# Altium schematic sheet RGB_CCM.SchDoc: =project_title
size Tabloid; PageSetup: Record=PageOptions|CenterHorizontal=True|CenterVertical=True|PrintScale=0.71|XCorrection=1.00|YCorrection=1.00|PrintKind=0|BorderSize=5000000|LeftOffset=0|BottomOffset=0|Orientation=2|PaperLength=1000|PaperWidth=1000|Scale=100|PaperSource=7|PrintQuality=-4|MediaType=1|DitherType=10|PrintScaleMode=1|PaperKind=A4; CompanyName: Luxonis Holding; Organization: Luxonis Holding; Address1: 1925 Harmony Park Drive; Address2: Westminster, CO; Address3: 80234; Address4: United States; SheetNumber: 12; SheetTotal: 13
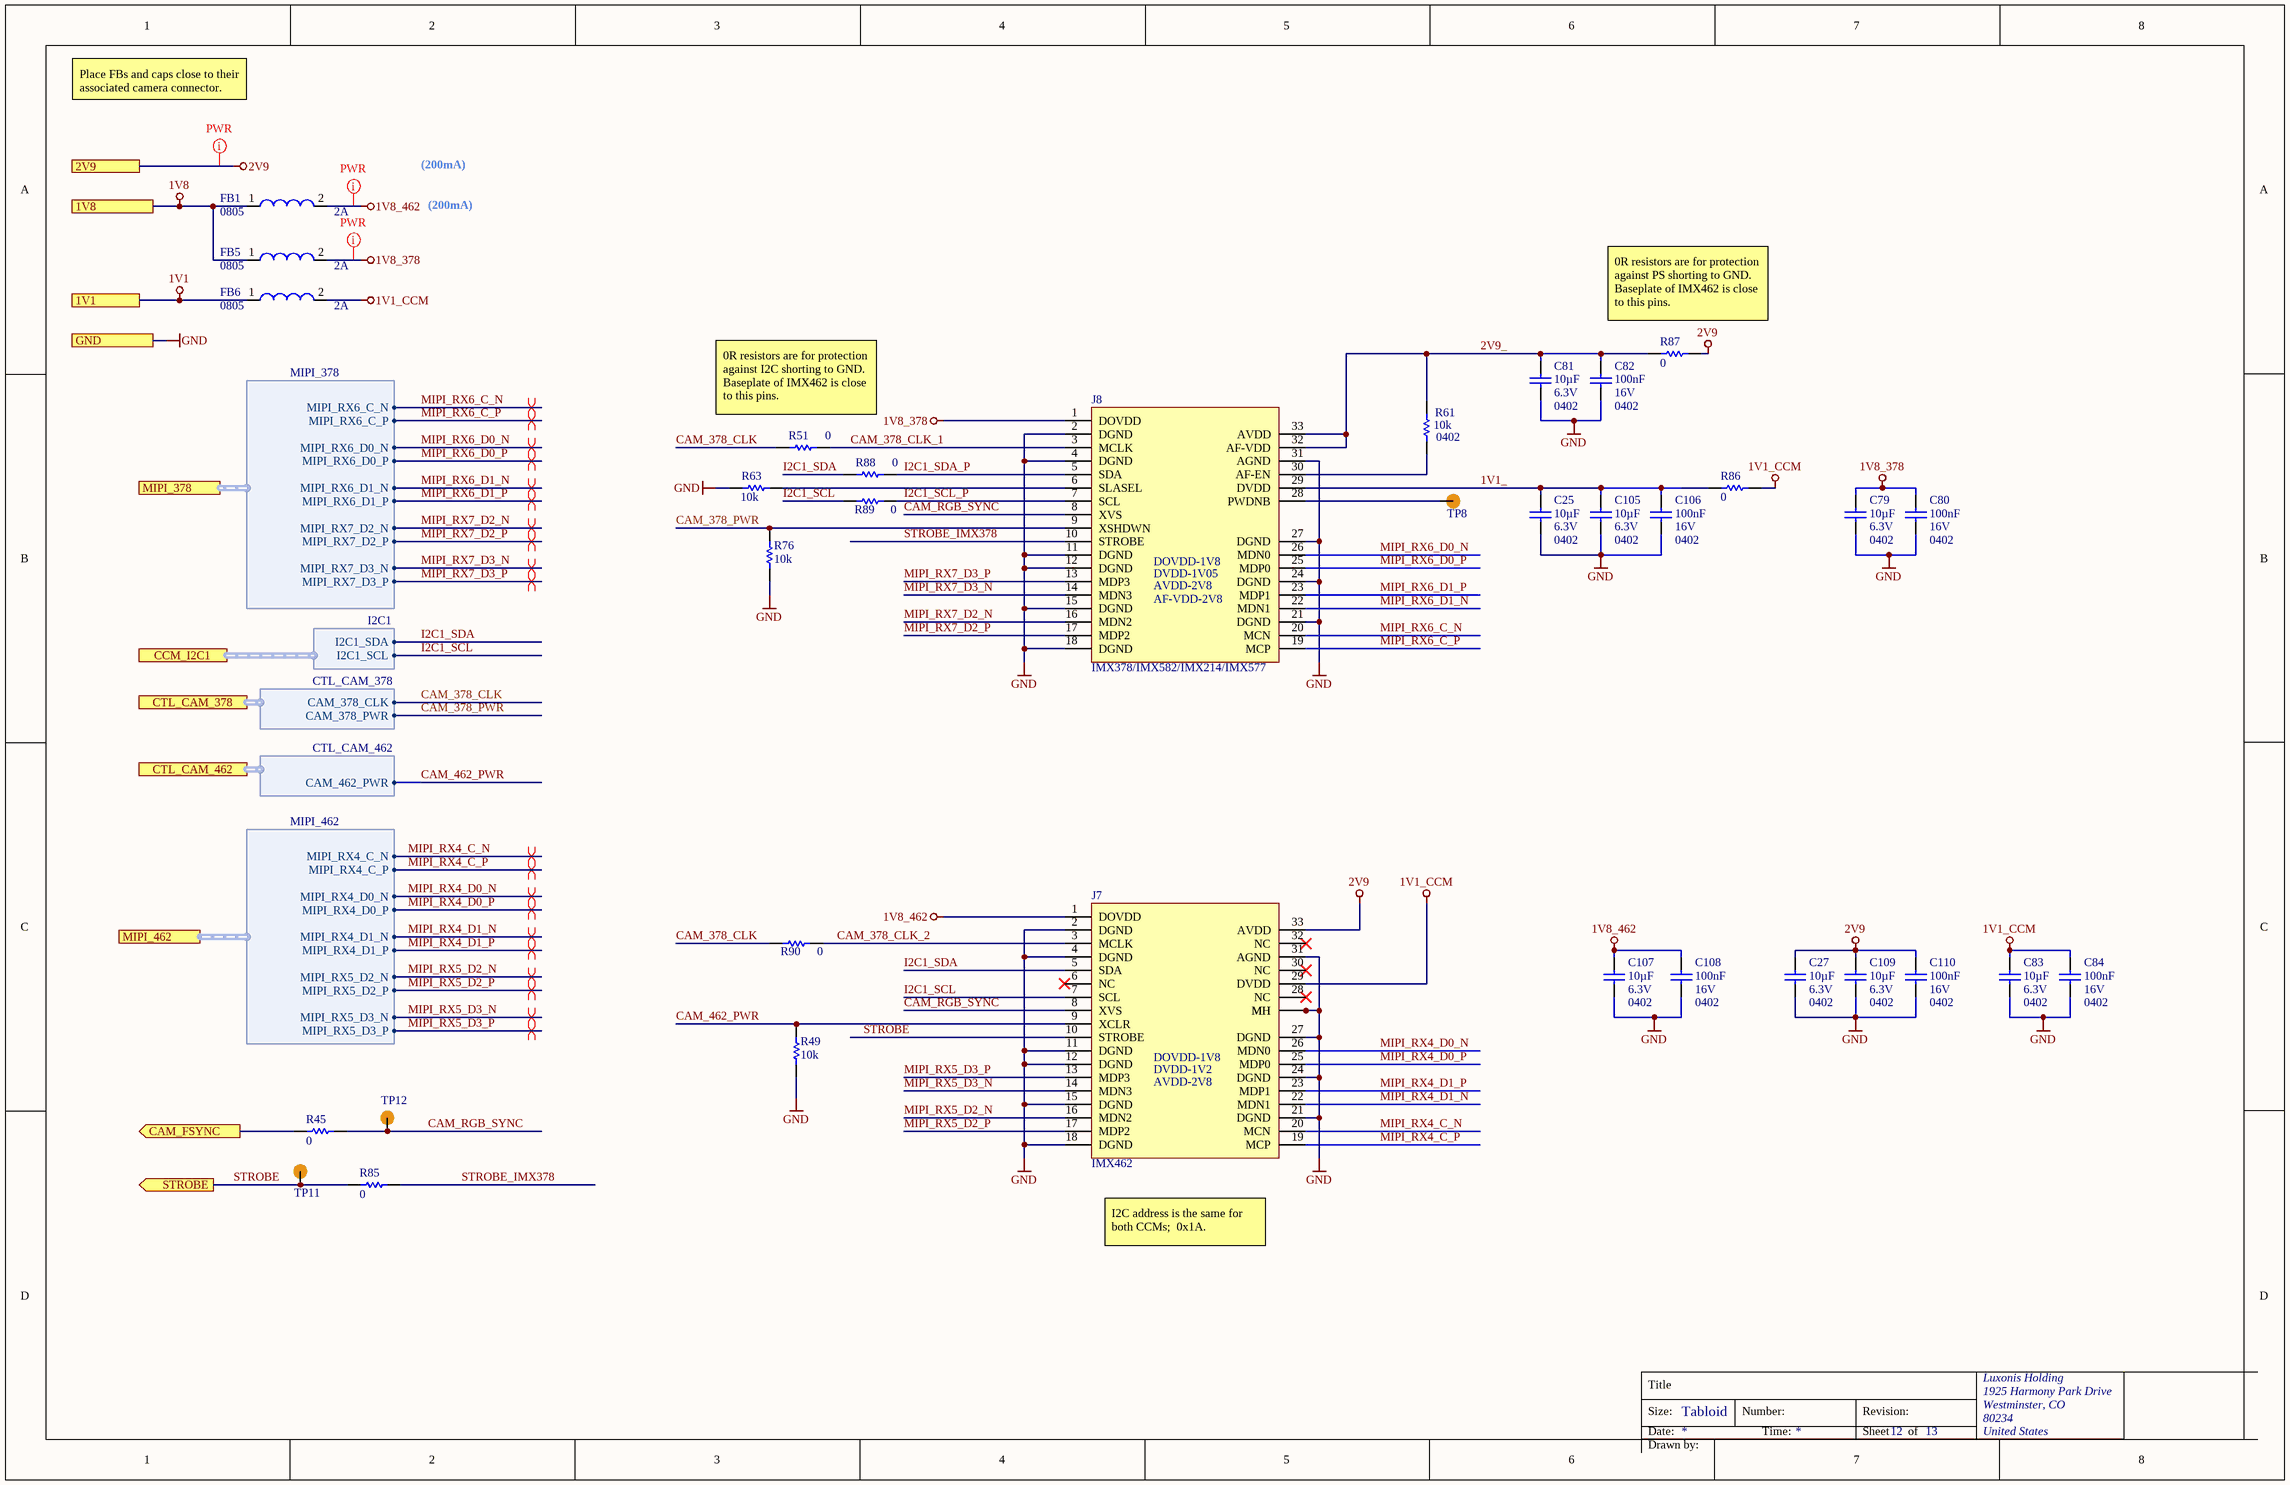
[diagram p0: RGB_CCM.SchDoc]

## Parts
C25  value 10µF  Voltage Rating: 6.3V  Case/Package: 0402  [CAPC0402(1005)70_L]  (hidden comment: GRM155R60J106ME15D)
C27  value 10µF  Voltage Rating: 6.3V  Case/Package: 0402  [CAPC0402(1005)70_L]  (hidden comment: GRM155R60J106ME15D)
C79  value 10µF  Voltage Rating: 6.3V  Case/Package: 0402  [CAPC0402(1005)70_L]  (hidden comment: GRM155R60J106ME15D)
C80  value 100nF  Voltage Rating: 16V  Case/Package: 0402  [CAPC0402(1005)60_L]  (hidden comment: CL05B104KO5NFNC)
C81  value 10µF  Voltage Rating: 6.3V  Case/Package: 0402  [CAPC0402(1005)70_L]  (hidden comment: GRM155R60J106ME15D)
C82  value 100nF  Voltage Rating: 16V  Case/Package: 0402  [CAPC0402(1005)60_L]  (hidden comment: CL05B104KO5NFNC)
C83  value 10µF  Voltage Rating: 6.3V  Case/Package: 0402  [CAPC0402(1005)70_L]  (hidden comment: GRM155R60J106ME15D)
C84  value 100nF  Voltage Rating: 16V  Case/Package: 0402  [CAPC0402(1005)60_L]  (hidden comment: CL05B104KO5NFNC)
C105  value 10µF  Voltage Rating: 6.3V  Case/Package: 0402  [CAPC0402(1005)70_L]  (hidden comment: GRM155R60J106ME15D)
C106  value 100nF  Voltage Rating: 16V  Case/Package: 0402  [CAPC0402(1005)60_L]  (hidden comment: CL05B104KO5NFNC)
C107  value 10µF  Voltage Rating: 6.3V  Case/Package: 0402  [CAPC0402(1005)70_L]  (hidden comment: GRM155R60J106ME15D)
C108  value 100nF  Voltage Rating: 16V  Case/Package: 0402  [CAPC0402(1005)60_L]  (hidden comment: CL05B104KO5NFNC)
C109  value 10µF  Voltage Rating: 6.3V  Case/Package: 0402  [CAPC0402(1005)70_L]  (hidden comment: GRM155R60J106ME15D)
C110  value 100nF  Voltage Rating: 16V  Case/Package: 0402  [CAPC0402(1005)60_L]  (hidden comment: CL05B104KO5NFNC)
FB1  Current Rating: 2A  Case/Package: 0805  [2508056017Y2]  (hidden comment: 2508056017Y2)
FB5  Current Rating: 2A  Case/Package: 0805  [2508056017Y2]  (hidden comment: 2508056017Y2)
FB6  Current Rating: 2A  Case/Package: 0805  [2508056017Y2]  (hidden comment: 2508056017Y2)
J7  IMX462  [AC_PY154-IMX462_CON]
J8  IMX378/IMX582/IMX214/IMX577  [PY004]
R45  0  [RESC0402(1005)_L]
R49  value 10k  [RESC0402(1005)_N]  (hidden comment: RC0402FR-1310KL)
R51  0  [RESC0402(1005)_L]
R61  value 10k  Case/Package: 0402  [RESC0402(1005)_N]  (hidden comment: RC0402FR-1310KL)
R63  value 10k  [RESC0402(1005)_N]  (hidden comment: RC0402FR-1310KL)
R76  value 10k  [RESC0402(1005)_N]  (hidden comment: RC0402FR-1310KL)
R85  0  [RESC0402(1005)_L]
R86  0  [RESC0402(1005)_L]
R87  0  [RESC0402(1005)_L]
R88  0  [RESC0402(1005)_L]
R89  0  [RESC0402(1005)_L]
R90  0  [RESC0402(1005)_L]
TP8  TEST_POINT  [TP075_150_NS]  (value not drawn)  (no BOM)
TP11  TEST_POINT  [TP075_150_NS]  (value not drawn)  (no BOM)
TP12  TEST_POINT  [TP075_150_NS]  (value not drawn)  (no BOM)

## Ports
1V1, 1V8, 2V9, CAM_FSYNC (out), CCM_I2C1 (harness I2C1), CTL_CAM_378 (harness CTL_CAM_378), CTL_CAM_462 (harness CTL_CAM_462), GND, MIPI_378 (harness MIPI_378), MIPI_462 (harness MIPI_462), STROBE (out)

## Harnesses
I2C1: I2C1_SDA, I2C1_SCL
CTL_CAM_462: CAM_462_PWR
CTL_CAM_378: CAM_378_CLK, CAM_378_PWR
MIPI_462: MIPI_RX4_C_N, MIPI_RX4_C_P, MIPI_RX4_D0_N, MIPI_RX4_D0_P, MIPI_RX4_D1_N, MIPI_RX4_D1_P, MIPI_RX5_D2_N, MIPI_RX5_D2_P, MIPI_RX5_D3_N, MIPI_RX5_D3_P
MIPI_378: MIPI_RX6_C_N, MIPI_RX6_C_P, MIPI_RX6_D0_N, MIPI_RX6_D0_P, MIPI_RX6_D1_N, MIPI_RX6_D1_P, MIPI_RX7_D2_N, MIPI_RX7_D2_P, MIPI_RX7_D3_N, MIPI_RX7_D3_P

## Nets
1V1: FB6.1 ; port 1V1
1V1_CCM: C83.2 C84.2 FB6.2 J7.29(DVDD) R86.1
1V8: FB1.1 FB5.1 ; port 1V8
1V8_378: C79.2 C80.2 FB5.2 J8.1(DOVDD)
1V8_462: C107.2 C108.2 FB1.2 J7.1(DOVDD)
2V9: C27.2 C109.2 C110.2 J7.33(AVDD) R87.1 ; port 2V9
GND: C25.1 C27.1 C79.1 C80.1 C81.1 C82.1 C83.1 C84.1 C105.1 C106.1 C107.1 C108.1 C109.1 C110.1 J7.2(DGND) J7.4(DGND) J7.11(DGND) J7.12(DGND) J7.15(DGND) J7.18(DGND) J7.21(DGND) J7.24(DGND) J7.27(DGND) J7.31(AGND) J7.34(MH) J7.35(MH) J8.2(DGND) J8.4(DGND) J8.11(DGND) J8.12(DGND) J8.15(DGND) J8.18(DGND) J8.21(DGND) J8.24(DGND) J8.27(DGND) J8.31(AGND) R49.2 R63.2 R76.2 ; port GND
1V1_: C25.2 C105.2 C106.2 J8.29(DVDD) R86.2
2V9_: C81.2 C82.2 J8.32(AF-VDD) J8.33(AVDD) R61.2 R87.2
CAM_378_CLK: R51.2 R90.2 ; port CTL_CAM_378.CAM_378_CLK
CAM_378_CLK_1: J8.3(MCLK) R51.1
CAM_378_CLK_2: J7.3(MCLK) R90.1
CAM_378_PWR: J8.9(XSHDWN) R76.1 ; port CTL_CAM_378.CAM_378_PWR
CAM_462_PWR: J7.9(XCLR) R49.1 ; port CTL_CAM_462.CAM_462_PWR
CAM_FSYNC: R45.2 ; port CAM_FSYNC
CAM_RGB_SYNC: J7.8(XVS) J8.8(XVS) R45.1 TP12.1
I2C1_SCL: J7.7(SCL) R89.2 ; port CCM_I2C1.I2C1_SCL
I2C1_SCL_P: J8.7(SCL) R89.1
I2C1_SDA: J7.5(SDA) R88.2 ; port CCM_I2C1.I2C1_SDA
I2C1_SDA_P: J8.5(SDA) R88.1
MIPI_RX4_C_N: J7.20(MCN) ; port MIPI_462.MIPI_RX4_C_N
MIPI_RX4_C_P: J7.19(MCP) ; port MIPI_462.MIPI_RX4_C_P
MIPI_RX4_D0_N: J7.26(MDN0) ; port MIPI_462.MIPI_RX4_D0_N
MIPI_RX4_D0_P: J7.25(MDP0) ; port MIPI_462.MIPI_RX4_D0_P
MIPI_RX4_D1_N: J7.22(MDN1) ; port MIPI_462.MIPI_RX4_D1_N
MIPI_RX4_D1_P: J7.23(MDP1) ; port MIPI_462.MIPI_RX4_D1_P
MIPI_RX5_D2_N: J7.16(MDN2) ; port MIPI_462.MIPI_RX5_D2_N
MIPI_RX5_D2_P: J7.17(MDP2) ; port MIPI_462.MIPI_RX5_D2_P
MIPI_RX5_D3_N: J7.14(MDN3) ; port MIPI_462.MIPI_RX5_D3_N
MIPI_RX5_D3_P: J7.13(MDP3) ; port MIPI_462.MIPI_RX5_D3_P
MIPI_RX6_C_N: J8.20(MCN) ; port MIPI_378.MIPI_RX6_C_N
MIPI_RX6_C_P: J8.19(MCP) ; port MIPI_378.MIPI_RX6_C_P
MIPI_RX6_D0_N: J8.26(MDN0) ; port MIPI_378.MIPI_RX6_D0_N
MIPI_RX6_D0_P: J8.25(MDP0) ; port MIPI_378.MIPI_RX6_D0_P
MIPI_RX6_D1_N: J8.22(MDN1) ; port MIPI_378.MIPI_RX6_D1_N
MIPI_RX6_D1_P: J8.23(MDP1) ; port MIPI_378.MIPI_RX6_D1_P
MIPI_RX7_D2_N: J8.16(MDN2) ; port MIPI_378.MIPI_RX7_D2_N
MIPI_RX7_D2_P: J8.17(MDP2) ; port MIPI_378.MIPI_RX7_D2_P
MIPI_RX7_D3_N: J8.14(MDN3) ; port MIPI_378.MIPI_RX7_D3_N
MIPI_RX7_D3_P: J8.13(MDP3) ; port MIPI_378.MIPI_RX7_D3_P
STROBE: J7.10(STROBE) R85.2 TP11.1 ; port STROBE
STROBE_IMX378: J8.10(STROBE) R85.1
NetJ8_6: J8.6(SLASEL) R63.1
NetJ8_28: J8.28(PWDNB) TP8.1
NetJ8_30: J8.30(AF-EN) R61.1

Not connected (* = marked no-connect by the designer): J7 6(NC)* 28(NC)* 30(NC)* 32(NC)*

## Layout directives
net class PWR; Current Rating: 200mA: 1V8_378, 1V8_462, 2V9
differential pair; differential pair class 100ohm: MIPI_RX4_C_N, MIPI_RX4_C_P, MIPI_RX4_D0_N, MIPI_RX4_D0_P, MIPI_RX4_D1_N, MIPI_RX4_D1_P, MIPI_RX5_D2_N, MIPI_RX5_D2_P, MIPI_RX5_D3_N, MIPI_RX5_D3_P, MIPI_RX6_C_N, MIPI_RX6_C_P, MIPI_RX6_D0_N, MIPI_RX6_D0_P, MIPI_RX6_D1_N, MIPI_RX6_D1_P, MIPI_RX7_D2_N, MIPI_RX7_D2_P, MIPI_RX7_D3_N, MIPI_RX7_D3_P

## Notes on the sheet
- Place FBs and caps close to their associated camera connector.
- (200mA)
- 0R resistors are for protection against PS shorting to GND. Baseplate of IMX462 is close to this pins.
- (near R51) 0R resistors are for protection against I2C shorting to GND. Baseplate of IMX462 is close to this pins.
- (near J8) (1V8)
- (near J8) (2V8)
- (near J8) (1V8 Level)
- I2C address is the same for both CCMs;  0x1A.
- Title
- Size:
- Date:
- Tabloid
- Number:
- Time:
- Revision:
- Sheet
- of
- Drawn by:
- (in symbol CMP-002-00191-10) DOVDD-1V8; DVDD-1V2; AVDD-2V8
- (in symbol CMP-005-000037-17) DOVDD-1V8; DVDD-1V05; AVDD-2V8; AF-VDD-2V8

## Library data of the parts
C25 C27 C79 C81 C83 C105 C107 C109 = CMP-004-000009-5: CAP CER 10UF 6.3V X5R 0402 20%; Manufacturer 1: Murata; Dielectric: X5R; Manufacturer Part Number 1: GRM155R60J106ME15D; ComponentLink1URL: https://www.murata.com/~/media/webrenewal/support/library/catalog/products/capacitor/mlcc/c02e.ashx?la=en-us&src-supplier=Digi-Key; Design Item ID: GRM155R60J106ME15D; Tolerance: 20%; Width: 0.02inch; Length: 0.039inch; Mounting Technology: SMT; Min Operating Temperature: -55°C; Max Operating Temperature: 85°C; ComponentLink1Description: https://www.murata.com/~/media/webrenewal/support/library/catalog/products/capacitor/mlcc/c02e.ashx?la=en-us&src-supplier=Digi-Key
C80 C82 C84 C106 C108 C110 = CMP-108-000002-6: CAP CER 0.1UF 16V X7R 0402 10%; Manufacturer 1: Samsung; ComponentLink1URL: https://datasheet.ciiva.com/25767/cl05b104ko5nfnc-25767124.pdf?src-supplier=Digi-Key; Length: 1mm; Design Item ID: CL05B104KO5NFNC; Tolerance: 10%; Min Operating Temperature: -55°C; Width: 0.02inch; Dielectric: X7R; ComponentLink1Description: https://datasheet.ciiva.com/25767/cl05b104ko5nfnc-25767124.pdf?src-supplier=Digi-Key; Height: 0.5mm; Depth: 0.5mm; Manufacturer Part Number 1: CL05B104KO5NFNC; Max Operating Temperature: 125°C; Mounting Technology: SMT
FB1 FB5 FB6 = CMP-082-000000-2: FERRITE BEAD, 0.1OHM, 2A, 0805, 600R/100MHz; Manufacturer 1: Fair-Rite; Tolerance: 25%; Manufacturer Part Number 1: 2508056017Y2
J7 = CMP-002-00191-10: FFC/FPC Connector, 33 Contact(s), 1 Row(s), Female, Right Angle, Surface Mount Terminal; Manufacturer Part Number 1: FH26W-33S-0.3SHW(60); Manufacturer 1: Hirose; ComponentLink2Description: https://www.hirose.com/product/en/download_file/key_name/FH26/category/Catalog/doc_file_id/49355/?file_category_id=4&item_id=298&is_series=1&src-supplier=Digi-Key; Pins: 33; ComponentLink3Description: https://www.hirose.com/product/download/?distributor=digikey&amp;type=2d&amp;lang=en&amp;num=FH26W-13S-0.3SHW(60)&src-supplier=Digi-Key; RoHS: Yes; ComponentLink3URL: https://www.hirose.com/product/download/?distributor=digikey&amp;type=2d&amp;lang=en&amp;num=FH26W-13S-0.3SHW(60)&src-supplier=Digi-Key; Source: LuxonisMaster.SchLib; Pricing 1: 1=1,78000, 10=1,61700, 25=1,51800, 50=1,45200, 100=1,38600, 250=1,25400, 500=1,15500, 1000=0,99000, 2500=0,92400 (USD); ComponentLink1Description: https://datasheet.ciiva.com:443/pdfs/VipMasterIC/IC/HIRO/HIRO-S-A0007913874/HIRO-S-A0008593114-1.pdf?src-supplier=IHS+Markit; ComponentLink1URL: https://datasheet.ciiva.com:443/pdfs/VipMasterIC/IC/HIRO/HIRO-S-A0007913874/HIRO-S-A0008593114-1.pdf?src-supplier=IHS+Markit; Category: FFC / FPC; Design Item ID: AC_PY111-IMX577_CON; Stock 1: 627; System: connector; ComponentLink2URL: https://www.hirose.com/product/en/download_file/key_name/FH26/category/Catalog/doc_file_id/49355/?file_category_id=4&item_id=298&is_series=1&src-supplier=Digi-Key
J8 = CMP-005-000037-17: FFC/FPC Connector, 33 Contact(s), 1 Row(s), Female, Right Angle, Surface Mount Terminal; Manufacturer Part Number 1: FH26W-33S-0.3SHW(60); Manufacturer 1: Hirose; ComponentLink3Description: https://www.hirose.com/product/download/?distributor=digikey&amp;type=2d&amp;lang=en&amp;num=FH26W-13S-0.3SHW(60)&src-supplier=Digi-Key; ComponentLink1URL: https://datasheet.ciiva.com:443/pdfs/VipMasterIC/IC/HIRO/HIRO-S-A0007913874/HIRO-S-A0008593114-1.pdf?src-supplier=IHS+Markit; Category: FFC / FPC; ComponentLink2URL: https://www.hirose.com/product/en/download_file/key_name/FH26/category/Catalog/doc_file_id/49355/?file_category_id=4&item_id=298&is_series=1&src-supplier=Digi-Key; ComponentLink1Description: https://datasheet.ciiva.com:443/pdfs/VipMasterIC/IC/HIRO/HIRO-S-A0007913874/HIRO-S-A0008593114-1.pdf?src-supplier=IHS+Markit; Pricing 1: 1=1,78000, 10=1,61700, 25=1,51800, 50=1,45200, 100=1,38600, 250=1,25400, 500=1,15500, 1000=0,99000, 2500=0,92400 (USD); ComponentLink2Description: https://www.hirose.com/product/en/download_file/key_name/FH26/category/Catalog/doc_file_id/49355/?file_category_id=4&item_id=298&is_series=1&src-supplier=Digi-Key; Source: LuxonisMaster.SchLib; Stock 1: 627; Design Item ID: AC_PY004-IMX378_CON; RoHS: Yes; Pins: 33; ComponentLink3URL: https://www.hirose.com/product/download/?distributor=digikey&amp;type=2d&amp;lang=en&amp;num=FH26W-13S-0.3SHW(60)&src-supplier=Digi-Key; System: connector
R45 R51 R85-R90 = CMP-013-000022-11: RES SMD 0 OHM 5% 1/16W 0402; Manufacturer 1: Vishay; Manufacturer Part Number 1: CRCW04020000Z0ED; Power Rating: 63mW; Voltage Rating: 50V; Case/Package: 0402; Min Operating Temperature: -55°C; Max Operating Temperature: 155°C; Tolerance: 5%; Value: 0; Design Item ID: CRCW04020000Z0ED
R49 R61 R63 R76 = CMP-115-000004-8: RES SMD 10K OHM 1% 1/16W 0402; Manufacturer 1: Yageo; Power Rating: 62.5mW; Temperature Coefficient: 100ppm/°C; Voltage Rating: 50V; Min Operating Temperature: -55°C; Max Operating Temperature: 155°C; Design Item ID: RC0402FR-1310KL; Tolerance: 1%; Manufacturer Part Number 1: RC0402FR-1310KL
  R49 R63 R76: Case/Package: 0402
TP8 TP11 TP12 = CMP-015-000000-5: Manufacturer Part Number 1: /; Design Item ID: TEST_POINT; Source: LuxonisMaster.SchLib